# Altium schematic sheet TK2560_MainBlock.SchDoc
size A3
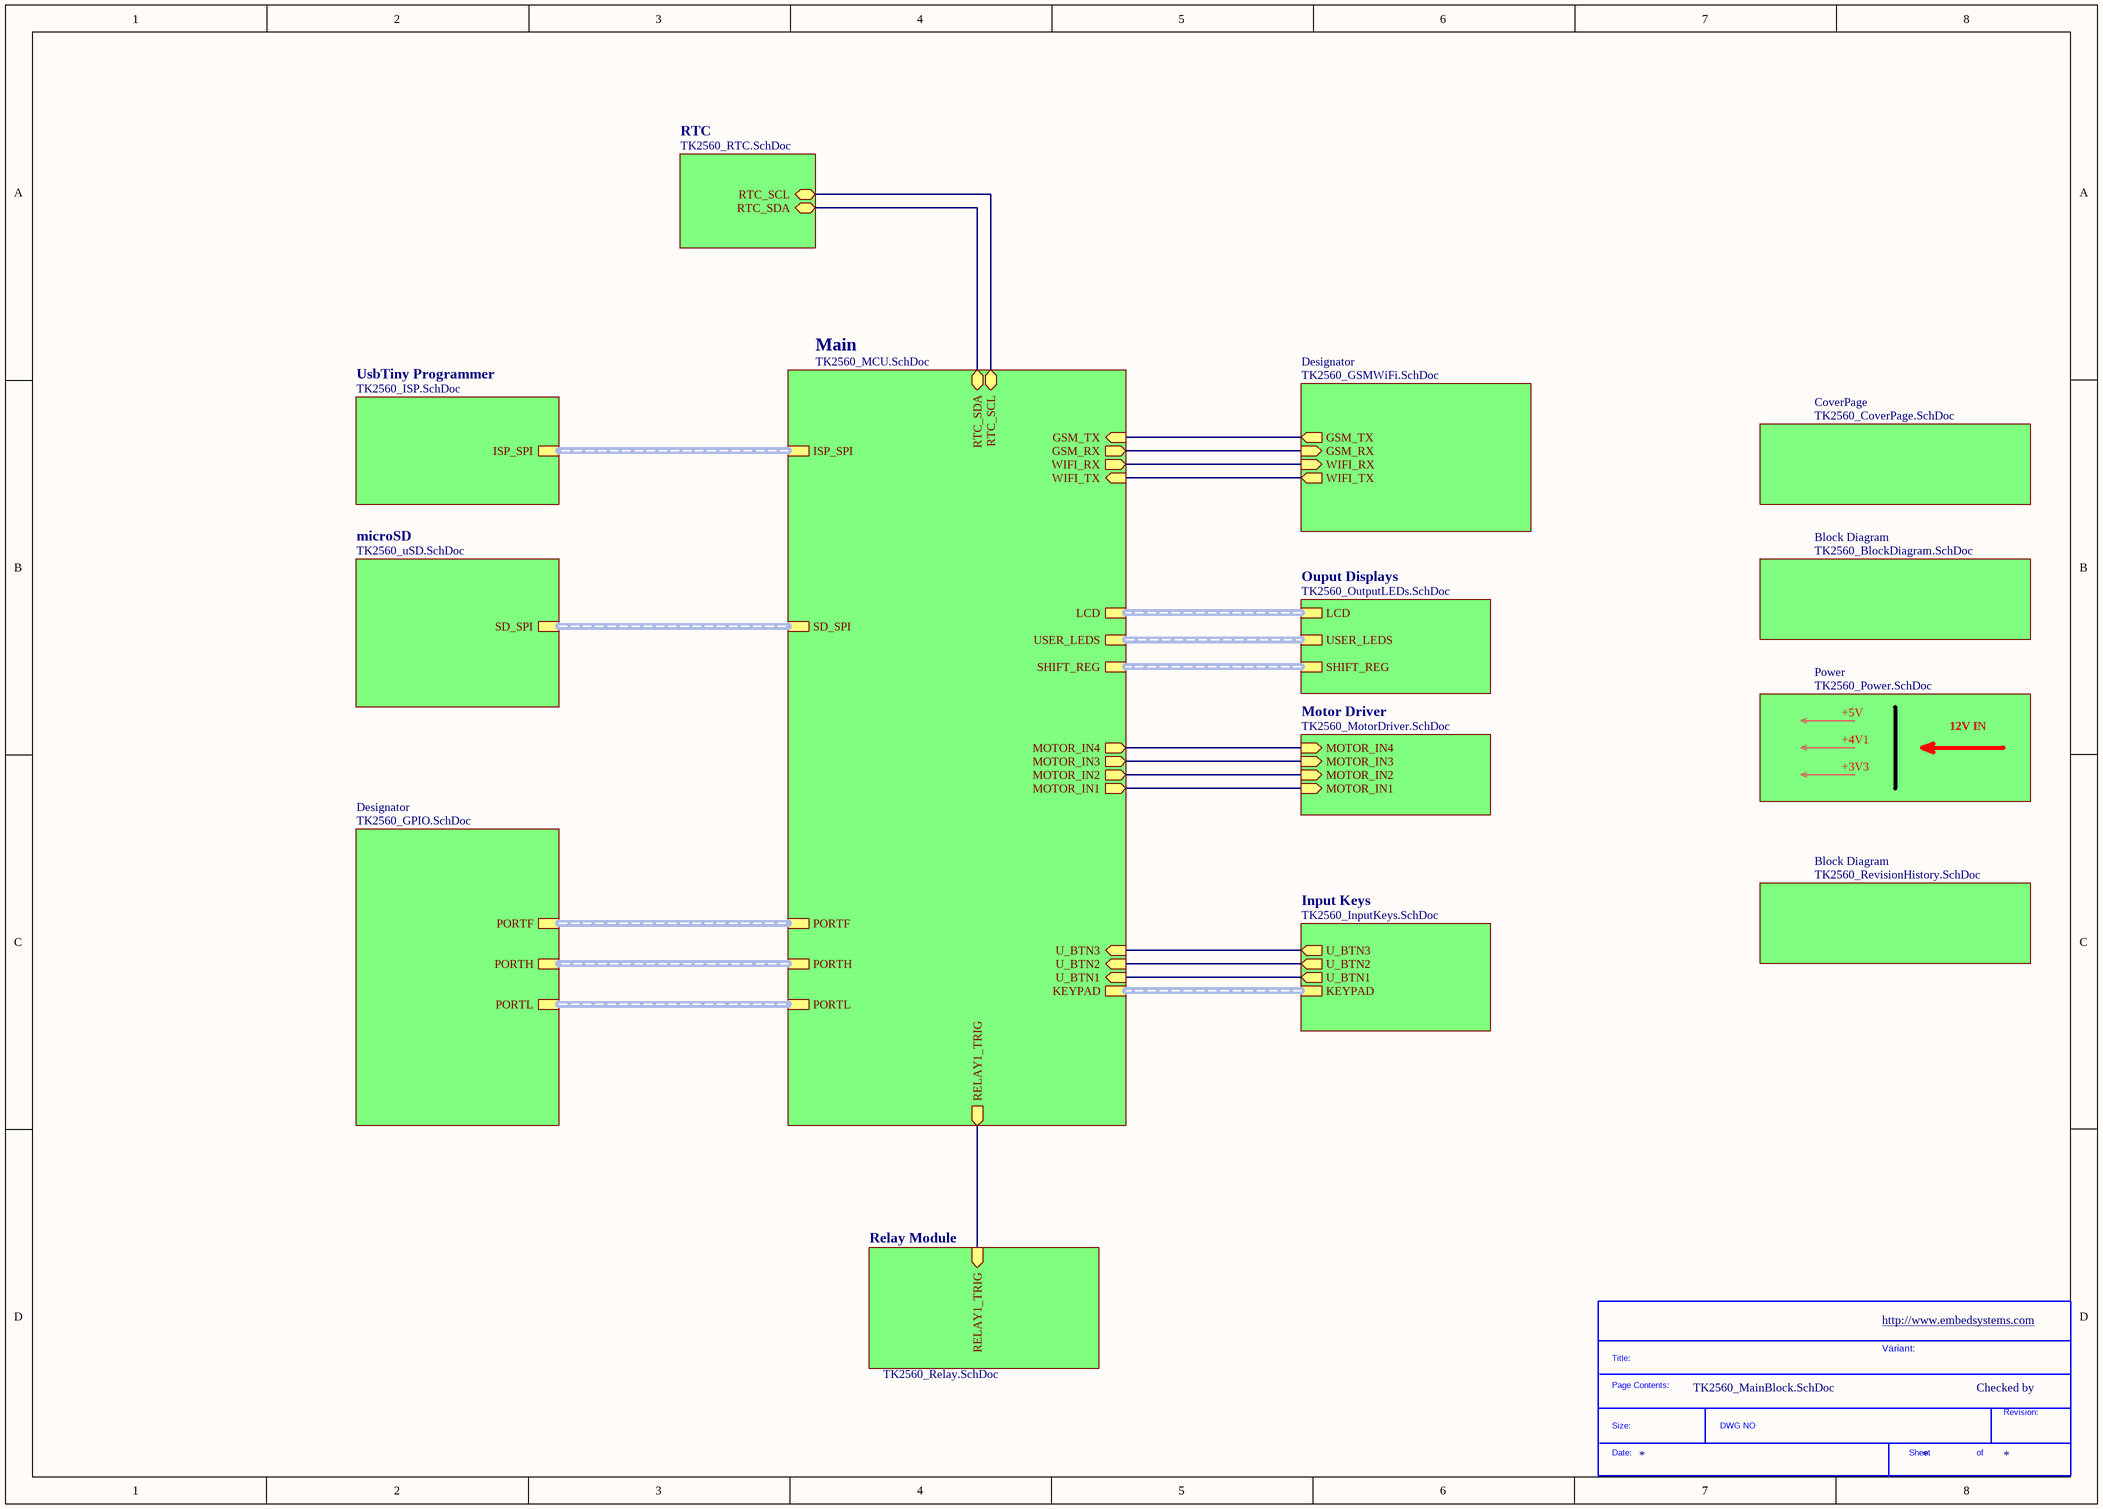
[diagram p0: TK2560_MainBlock.SchDoc]

## Parts
*?  SDTitleBlock  (value not drawn)  (graphical)

## Sub-sheets
Block Diagram = TK2560_BlockDiagram.SchDoc: no entries
Block Diagram = TK2560_RevisionHistory.SchDoc: no entries
CoverPage = TK2560_CoverPage.SchDoc: no entries
Designator = TK2560_GPIO.SchDoc: PORTL (harness PORTL), PORTH (harness PORTH), PORTF (harness PORTF)
Designator = TK2560_GSMWiFi.SchDoc: GSM_TX (out), GSM_RX (in), WIFI_RX (in), WIFI_TX (out)
Input Keys = TK2560_InputKeys.SchDoc: U_BTN1 (out), U_BTN2 (out), U_BTN3 (out), KEYPAD (harness KEYPAD)
Main = TK2560_MCU.SchDoc: SD_SPI (harness SD_SPI), KEYPAD (harness KEYPAD), LCD (harness LCD), RTC_SCL (bidir), ISP_SPI (harness ISP_SPI), RELAY1_TRIG (out), U_BTN1 (in), RTC_SDA (bidir), U_BTN2 (in), USER_LEDS (harness USER_LEDS), U_BTN3 (in), PORTF (harness PORTF), SHIFT_REG (harness SHIFT_REG), GSM_RX (out), GSM_TX (in), WIFI_TX (in), WIFI_RX (out), MOTOR_IN4 (out), MOTOR_IN1 (out), MOTOR_IN3 (out), MOTOR_IN2 (out), PORTL (harness PORTL), PORTH (harness PORTH)
microSD = TK2560_uSD.SchDoc: SD_SPI (harness SD_SPI)
Motor Driver = TK2560_MotorDriver.SchDoc: MOTOR_IN1 (in), MOTOR_IN4 (in), MOTOR_IN2 (in), MOTOR_IN3 (in)
Ouput Displays = TK2560_OutputLEDs.SchDoc: USER_LEDS (harness USER_LEDS), LCD (harness LCD), SHIFT_REG (harness SHIFT_REG)
Power = TK2560_Power.SchDoc: no entries
Relay Module = TK2560_Relay.SchDoc: RELAY1_TRIG (in)
RTC = TK2560_RTC.SchDoc: RTC_SCL (bidir), RTC_SDA (bidir)
UsbTiny Programmer = TK2560_ISP.SchDoc: ISP_SPI (harness ISP_SPI)

## Nets
(unnamed): sheet Main/RTC_SCL, sheet RTC/RTC_SCL
(unnamed): sheet Main/RELAY1_TRIG, sheet Relay Module/RELAY1_TRIG
(unnamed): sheet Main/U_BTN1, sheet Input Keys/U_BTN1
(unnamed): sheet Main/RTC_SDA, sheet RTC/RTC_SDA
(unnamed): sheet Main/U_BTN2, sheet Input Keys/U_BTN2
(unnamed): sheet Main/U_BTN3, sheet Input Keys/U_BTN3
(unnamed): sheet Main/GSM_RX, sheet Designator/GSM_RX
(unnamed): sheet Main/GSM_TX, sheet Designator/GSM_TX
(unnamed): sheet Main/WIFI_TX, sheet Designator/WIFI_TX
(unnamed): sheet Main/WIFI_RX, sheet Designator/WIFI_RX
(unnamed): sheet Main/MOTOR_IN4, sheet Motor Driver/MOTOR_IN4
(unnamed): sheet Main/MOTOR_IN1, sheet Motor Driver/MOTOR_IN1
(unnamed): sheet Main/MOTOR_IN3, sheet Motor Driver/MOTOR_IN3
(unnamed): sheet Main/MOTOR_IN2, sheet Motor Driver/MOTOR_IN2

## Buses and harness runs
harness sheet Designator/PORTF = sheet Main/PORTF
harness sheet Designator/PORTH = sheet Main/PORTH
harness sheet Designator/PORTL = sheet Main/PORTL
harness sheet Input Keys/KEYPAD = sheet Main/KEYPAD
harness sheet Main/ISP_SPI = sheet UsbTiny Programmer/ISP_SPI
harness sheet Main/LCD = sheet Ouput Displays/LCD
harness sheet Main/SD_SPI = sheet microSD/SD_SPI
harness sheet Main/SHIFT_REG = sheet Ouput Displays/SHIFT_REG
harness sheet Main/USER_LEDS = sheet Ouput Displays/USER_LEDS

## Notes on the sheet
- +5V
- +4V1
- +3V3
- 12V IN
- http://www.embedsystems.com
- Variant:
- Checked by
- (in symbol SDTitleBlock) Title:; Page Contents:; Revision:; Size:; DWG NO; Date:; Sheet; of